# EAGLE schematic Papilio_Benchy (EAGLE 6.5.0)

## Sheet 1 of 5: FPGA
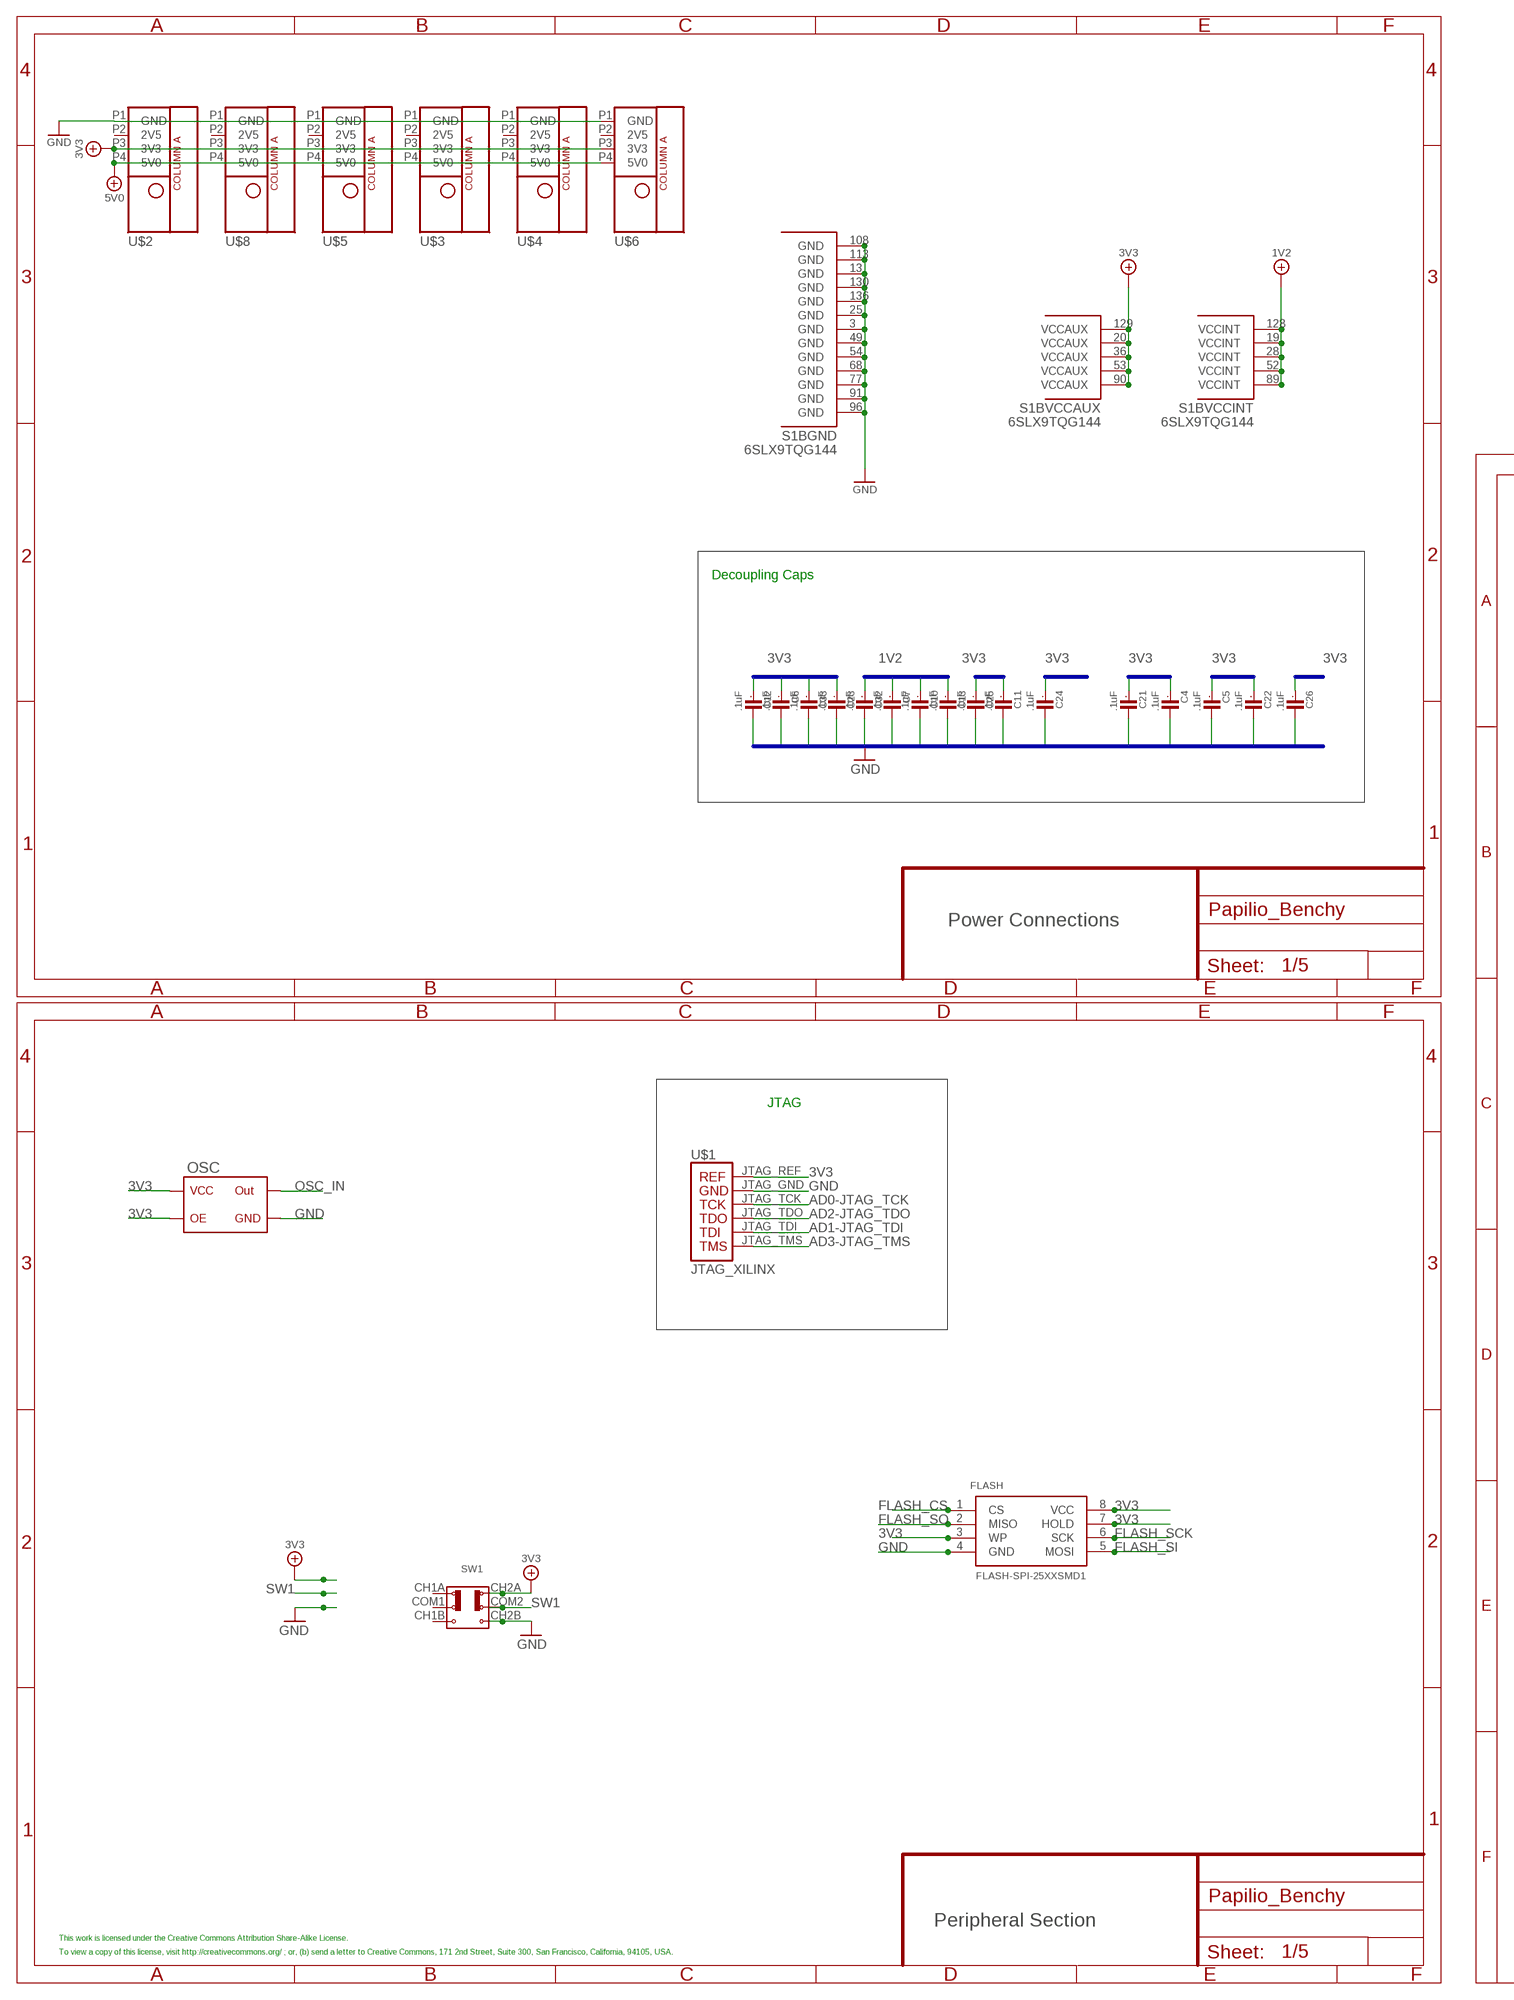
[diagram p0: schematic, sheet 1, part 1 of 2]
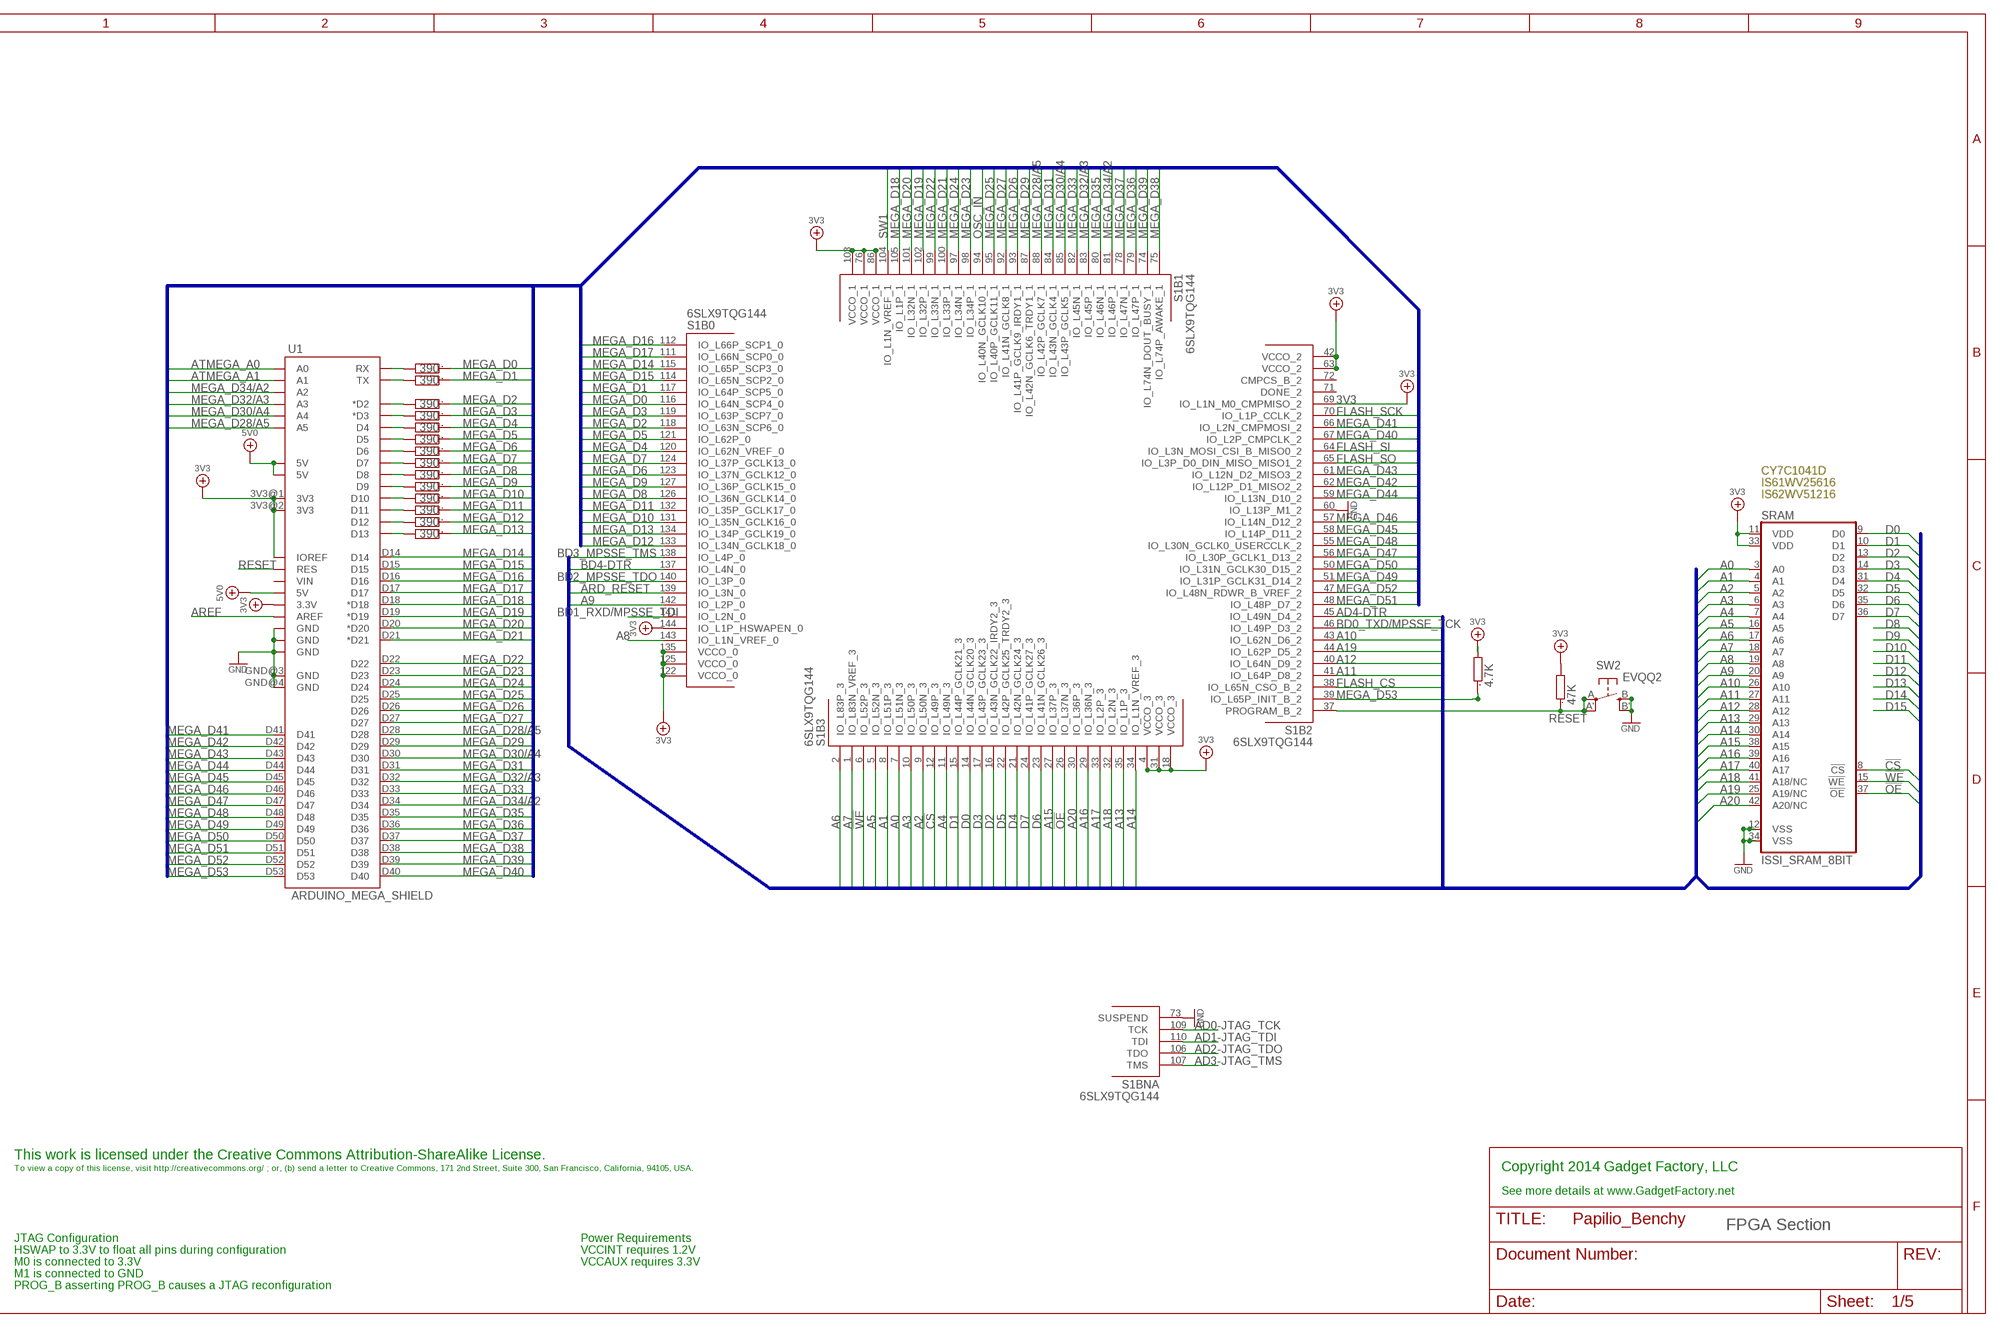
[diagram p1: schematic, sheet 1, part 2 of 2]

### Parts
C4  .1uF  C0603  [0603]
C5  .1uF  C0603  [0603]
C6  .1uF  C0603  [0603]
C7  .1uF  C0603  [0603]
C10  .1uF  C0603  [0603]
C11  .1uF  C0603  [0603]
C12  .1uF  C0603  [0603]
C13  .1uF  C0603  [0603]
C21  .1uF  C0603  [0603]
C22  .1uF  C0603  [0603]
C23  .1uF  C0603  [0603]
C24  .1uF  C0603  [0603]
C25  .1uF  C0603  [0603]
C26  .1uF  C0603  [0603]
C32  .1uF  C0603  [0603]
C33  .1uF  C0603  [0603]
FLASH  FLASH-SPI-25XXSMD1  [SO08-EIAJ]
OSC  OSC1  [OSC1]
R8  390  R0603  [0603]
R9  390  R0603  [0603]
R10  390  R0603  [0603]
R11  390  R0603  [0603]
R12  390  R0603  [0603]
R13  390  R0603  [0603]
R14  390  R0603  [0603]
R15  390  R0603  [0603]
R16  390  R0603  [0603]
R17  390  R0603  [0603]
R18  390  R0603  [0603]
R19  390  R0603  [0603]
R20  390  R0603  [0603]
R21  390  R0603  [0603]
R31  47K  R0805  [0805]
R32  4.7K  R0603  [0603]
S1  6SLX9TQG144  [TQ144]
SRAM  ISSI_SRAM_8BIT  [TSOP44-II]
SW1  SWITCH-2CH-6P-3010010P1  [6P-2CH-2.54-9.1X3.5X3.2+2H]
SW2  EVQQ2  [EVQ-Q2]
U1  ARDUINO_MEGA_SHIELD  [ARDUINO_MEGA_SHIELD]
U$1  JTAG_XILINX  [JTAG]
U$2  POWER_ONLYNOTEXT  [POWER_NO_TEXT]
U$3  POWER_ONLYNOTEXT  [POWER_NO_TEXT]
U$4  POWER_ONLYNOTEXT  [POWER_NO_TEXT]
U$5  POWER_ONLYNOTEXT  [POWER_NO_TEXT]
U$6  POWER_ONLYNOTEXT  [POWER_NO_TEXT]
U$8  POWER_ONLYNOTEXT  [POWER_NO_TEXT]

### Nets
1V2: C7.1 C10.1 C13.1 C32.1 S1.19(BVCCINT:VCCINT) S1.28(BVCCINT:VCCINT) S1.52(BVCCINT:VCCINT) S1.89(BVCCINT:VCCINT) S1.128(BVCCINT:VCCINT) ; also sheet 2
3V3: C4.1 C5.1 C6.1 C11.1 C12.1 C21.1 C22.1 C23.1 C24.1 C25.1 C26.1 C33.1 FLASH.3(WP) FLASH.7(HOLD) FLASH.8(VCC) OSC.1@1(OE) OSC.4@4(VCC) R31.2 R32.2 S1.4(B3:VCCO_3) S1.18(B3:VCCO_3) S1.20(BVCCAUX:VCCAUX) S1.31(B3:VCCO_3) S1.36(BVCCAUX:VCCAUX) S1.42(B2:VCCO_2) S1.53(BVCCAUX:VCCAUX) S1.63(B2:VCCO_2) S1.69(B2:IO_L1N_M0_CMPMISO_2) S1.76(B1:VCCO_1) S1.86(B1:VCCO_1) S1.90(BVCCAUX:VCCAUX) S1.103(B1:VCCO_1) S1.122(B0:VCCO_0) S1.125(B0:VCCO_0) S1.129(BVCCAUX:VCCAUX) S1.135(B0:VCCO_0) S1.144(B0:IO_L1P_HSWAPEN_0) SRAM.11(VDD) SRAM.33(VDD) SW1.CH2A U1.3.3V U1.3V3@1(3V3) U1.3V3@2(3V3) U1.IOREF U$1.JTAG_REF U$2.P3(3V3) U$3.P3(3V3) U$4.P3(3V3) U$5.P3(3V3) U$6.P3(3V3) U$8.P3(3V3) ; also sheet 2,3,4,5
5V0: U1.5V@0(5V) U1.5V@1(5V) U1.5V@2(5V) U$2.P4(5V0) U$3.P4(5V0) U$4.P4(5V0) U$5.P4(5V0) U$6.P4(5V0) U$8.P4(5V0) ; also sheet 2,5
!CS: S1.12(B3:IO_L49P_3) SRAM.8(!CS)
!OE: S1.26(B3:IO_L37N_3) SRAM.37(!OE)
!WE: S1.6(B3:IO_L52P_3) SRAM.15(!WE)
A0: S1.7(B3:IO_L51N_3) SRAM.3(A0)
A1: S1.8(B3:IO_L51P_3) SRAM.4(A1)
A2: S1.9(B3:IO_L50N_3) SRAM.5(A2)
A3: S1.10(B3:IO_L50P_3) SRAM.6(A3)
A4: S1.11(B3:IO_L49N_3) SRAM.7(A4)
A5: S1.5(B3:IO_L52N_3) SRAM.16(A5)
A6: S1.2(B3:IO_L83P_3) SRAM.17(A6)
A7: S1.1(B3:IO_L83N_VREF_3) SRAM.18(A7)
A8: S1.143(B0:IO_L1N_VREF_0) SRAM.19(A8)
A9: S1.142(B0:IO_L2P_0) SRAM.20(A9)
A10: S1.43(B2:IO_L62N_D6_2) SRAM.26(A10)
A11: S1.41(B2:IO_L64P_D8_2) SRAM.27(A11)
A12: S1.40(B2:IO_L64N_D9_2) SRAM.28(A12)
A13: S1.35(B3:IO_L1P_3) SRAM.29(A13)
A14: S1.34(B3:IO_L1N_VREF_3) SRAM.30(A14)
A15: S1.27(B3:IO_L37P_3) SRAM.38(A15)
A16: S1.29(B3:IO_L36N_3) SRAM.39(A16)
A17: S1.33(B3:IO_L2P_3) SRAM.40(A17)
A18: S1.32(B3:IO_L2N_3) SRAM.41(A18/NC)
A19: S1.44(B2:IO_L62P_D5_2) SRAM.25(A19/NC)
A20: S1.30(B3:IO_L36P_3) SRAM.42(A20/NC)
AD0-JTAG_TCK: S1.109(BNA:TCK) U$1.JTAG_TCK ; also sheet 3
AD1-JTAG_TDI: S1.110(BNA:TDI) U$1.JTAG_TDI ; also sheet 3
AD2-JTAG_TDO: S1.106(BNA:TDO) U$1.JTAG_TDO ; also sheet 3
AD3-JTAG_TMS: S1.107(BNA:TMS) U$1.JTAG_TMS ; also sheet 3
AD4-DTR: S1.45(B2:IO_L49N_D4_2) ; also sheet 3
ARD_RESET: S1.139(B0:IO_L3N_0) ; also sheet 4
AREF [aref]: U1.AREF ; also sheet 4
ATMEGA_A0: U1.A0 ; also sheet 4
ATMEGA_A1: U1.A1 ; also sheet 4
ATMEGA_D0/RX: R21.2 U1.RX ; also sheet 4
ATMEGA_D1/TX: R20.2 U1.TX ; also sheet 4
ATMEGA_D2: R19.2 U1.D2(*D2) ; also sheet 4
ATMEGA_D3: R18.2 U1.D3(*D3) ; also sheet 4
ATMEGA_D4: R17.2 U1.D4 ; also sheet 4
ATMEGA_D5*: R16.2 U1.D5 ; also sheet 4
ATMEGA_D6*: R15.2 U1.D6 ; also sheet 4
ATMEGA_D7: R14.2 U1.D7 ; also sheet 4
ATMEGA_IO8: R13.2 U1.D8 ; also sheet 4
ATMEGA_IO9*: R12.2 U1.D9 ; also sheet 4
ATMEGA_IO10*: R11.2 U1.D10 ; also sheet 4
ATMEGA_IO11*: R10.2 U1.D11 ; also sheet 4
ATMEGA_IO12: R9.2 U1.D12 ; also sheet 4
ATMEGA_IO13*: R8.2 U1.D13 ; also sheet 4
BD0_TXD/MPSSE_TCK: S1.46(B2:IO_L49P_D3_2) ; also sheet 3
BD1_RXD/MPSSE_TDI: S1.141(B0:IO_L2N_0) ; also sheet 3
BD2_MPSSE_TDO: S1.140(B0:IO_L3P_0) ; also sheet 3
BD3_MPSSE_TMS: S1.138(B0:IO_L4P_0) ; also sheet 3
BD4-DTR: S1.137(B0:IO_L4N_0) ; also sheet 3
D0: S1.14(B3:IO_L44N_GCLK20_3) SRAM.9(D0)
D1: S1.15(B3:IO_L44P_GCLK21_3) SRAM.10(D1)
D2: S1.16(B3:IO_L43N_GCLK22_IRDY2_3) SRAM.13(D2)
D3: S1.17(B3:IO_L43P_GCLK23_3) SRAM.14(D3)
D4: S1.21(B3:IO_L42N_GCLK24_3) SRAM.31(D4)
D5: S1.22(B3:IO_L42P_GCLK25_TRDY2_3) SRAM.32(D5)
D6: S1.23(B3:IO_L41N_GCLK26_3) SRAM.35(D6)
D7: S1.24(B3:IO_L41P_GCLK27_3) SRAM.36(D7)
FLASH_CS: FLASH.1(CS) S1.38(B2:IO_L65N_CSO_B_2)
FLASH_SCK: FLASH.6(SCK) S1.70(B2:IO_L1P_CCLK_2)
FLASH_SI: FLASH.5(MOSI) S1.64(B2:IO_L3N_MOSI_CSI_B_MISO0_2)
FLASH_SO: FLASH.2(MISO) S1.65(B2:IO_L3P_D0_DIN_MISO_MISO1_2)
GND: C4.2 C5.2 C6.2 C7.2 C10.2 C11.2 C12.2 C13.2 C21.2 C22.2 C23.2 C24.2 C25.2 C26.2 C32.2 C33.2 FLASH.4(GND) OSC.2@2(GND) S1.3(BGND:GND) S1.13(BGND:GND) S1.25(BGND:GND) S1.49(BGND:GND) S1.54(BGND:GND) S1.60(B2:IO_L13P_M1_2) S1.68(BGND:GND) S1.73(BNA:SUSPEND) S1.77(BGND:GND) S1.91(BGND:GND) S1.96(BGND:GND) S1.108(BGND:GND) S1.113(BGND:GND) S1.130(BGND:GND) S1.136(BGND:GND) SRAM.12(VSS) SRAM.34(VSS) SW1.CH2B SW2.B'(S1) SW2.B(S) U1.GND@0(GND) U1.GND@1(GND) U1.GND@2(GND) U1.GND@3(GND) U1.GND@4(GND) U$1.JTAG_GND U$2.P1(GND) U$3.P1(GND) U$4.P1(GND) U$5.P1(GND) U$6.P1(GND) U$8.P1(GND) ; also sheet 2,3,4,5
MEGA_D0: R21.1 S1.116(B0:IO_L64N_SCP4_0)
MEGA_D1: R20.1 S1.117(B0:IO_L64P_SCP5_0)
MEGA_D2: R19.1 S1.118(B0:IO_L63N_SCP6_0)
MEGA_D3: R18.1 S1.119(B0:IO_L63P_SCP7_0)
MEGA_D4: R17.1 S1.120(B0:IO_L62N_VREF_0)
MEGA_D5: R16.1 S1.121(B0:IO_L62P_0)
MEGA_D6: R15.1 S1.123(B0:IO_L37N_GCLK12_0)
MEGA_D7: R14.1 S1.124(B0:IO_L37P_GCLK13_0)
MEGA_D8: R13.1 S1.126(B0:IO_L36N_GCLK14_0)
MEGA_D9: R12.1 S1.127(B0:IO_L36P_GCLK15_0)
MEGA_D10: R11.1 S1.131(B0:IO_L35N_GCLK16_0)
MEGA_D11: R10.1 S1.132(B0:IO_L35P_GCLK17_0)
MEGA_D12: R9.1 S1.133(B0:IO_L34N_GCLK18_0)
MEGA_D13: R8.1 S1.134(B0:IO_L34P_GCLK19_0)
MEGA_D14: S1.115(B0:IO_L65P_SCP3_0) U1.D14 ; also sheet 4
MEGA_D15: S1.114(B0:IO_L65N_SCP2_0) U1.D15 ; also sheet 4
MEGA_D16: S1.112(B0:IO_L66P_SCP1_0) U1.D16 ; also sheet 4
MEGA_D17: S1.111(B0:IO_L66N_SCP0_0) U1.D17
MEGA_D18: S1.105(B1:IO_L1P_1) U1.D18(*D18)
MEGA_D19: S1.102(B1:IO_L32P_1) U1.D19(*D19)
MEGA_D20: S1.101(B1:IO_L32N_1) U1.D20(*D20)
MEGA_D21: S1.100(B1:IO_L33P_1) U1.D21(*D21)
MEGA_D22: S1.99(B1:IO_L33N_1) U1.D22
MEGA_D23: S1.98(B1:IO_L34P_1) U1.D23
MEGA_D24: S1.97(B1:IO_L34N_1) U1.D24
MEGA_D25: S1.95(B1:IO_L40P_GCLK11_1) U1.D25
MEGA_D26: S1.93(B1:IO_L41P_GCLK9_IRDY1_1) U1.D26
MEGA_D27: S1.92(B1:IO_L41N_GCLK8_1) U1.D27
MEGA_D28/A5: S1.88(B1:IO_L42P_GCLK7_1) U1.A5 U1.D28 ; also sheet 4
MEGA_D29: S1.87(B1:IO_L42N_GCLK6_TRDY1_1) U1.D29
MEGA_D30/A4: S1.85(B1:IO_L43P_GCLK5_1) U1.A4 U1.D30 ; also sheet 4
MEGA_D31: S1.84(B1:IO_L43N_GCLK4_1) U1.D31
MEGA_D32/A3: S1.83(B1:IO_L45P_1) U1.A3 U1.D32 ; also sheet 4
MEGA_D33: S1.82(B1:IO_L45N_1) U1.D33
MEGA_D34/A2: S1.81(B1:IO_L46P_1) U1.A2 U1.D34 ; also sheet 4
MEGA_D35: S1.80(B1:IO_L46N_1) U1.D35
MEGA_D36: S1.79(B1:IO_L47P_1) U1.D36
MEGA_D37: S1.78(B1:IO_L47N_1) U1.D37
MEGA_D38: S1.75(B1:IO_L74P_AWAKE_1) U1.D38
MEGA_D39: S1.74(B1:IO_L74N_DOUT_BUSY_1) U1.D39
MEGA_D40: S1.67(B2:IO_L2P_CMPCLK_2) U1.D40
MEGA_D41: S1.66(B2:IO_L2N_CMPMOSI_2) U1.D41
MEGA_D42: S1.62(B2:IO_L12P_D1_MISO2_2) U1.D42
MEGA_D43: S1.61(B2:IO_L12N_D2_MISO3_2) U1.D43 ; also sheet 5
MEGA_D44: S1.59(B2:IO_L13N_D10_2) U1.D44 ; also sheet 5
MEGA_D45: S1.58(B2:IO_L14P_D11_2) U1.D45 ; also sheet 5
MEGA_D46: S1.57(B2:IO_L14N_D12_2) U1.D46 ; also sheet 5
MEGA_D47: S1.56(B2:IO_L30P_GCLK1_D13_2) U1.D47 ; also sheet 5
MEGA_D48: S1.55(B2:IO_L30N_GCLK0_USERCCLK_2) U1.D48 ; also sheet 5
MEGA_D49: S1.51(B2:IO_L31P_GCLK31_D14_2) U1.D49 ; also sheet 5
MEGA_D50: S1.50(B2:IO_L31N_GCLK30_D15_2) U1.D50 ; also sheet 5
MEGA_D51: S1.48(B2:IO_L48P_D7_2) U1.D51 ; also sheet 5
MEGA_D52: S1.47(B2:IO_L48N_RDWR_B_VREF_2) U1.D52 ; also sheet 5
MEGA_D53: R32.1 S1.39(B2:IO_L65P_INIT_B_2) U1.D53 ; also sheet 5
OSC_IN: OSC.3@3(OUT) S1.94(B1:IO_L40N_GCLK10_1)
RESET: R31.1 S1.37(B2:PROGRAM_B_2) SW2.A'(P1) SW2.A(P) U1.RES
SW1: S1.104(B1:IO_L1N_VREF_1) SW1.COM2
Unconnected: S1.71(B2:DONE_2) S1.72(B2:CMPCS_B_2) SW1.CH1A SW1.CH1B SW1.COM1 U1.VIN U$2.P2(2V5) U$3.P2(2V5) U$4.P2(2V5) U$5.P2(2V5) U$6.P2(2V5) U$8.P2(2V5)

### Buses
GND
1V2
MEGA_A[0..15],MEGA_D[0..53],W1_B[1..16],OSC_IN,FLASH_SCK,FLASH_SI,FLASH_SO,FLASH_CS,USB_TXD,USB_RXD,LED1,LED2,LED3,LED4
3V3
A[0..20],D[0..15],CS,WE,OE,BE,LED4

### Notes on the sheet
- Decoupling Caps
- Power Connections
- CY7C1041D
- IS61WV25616
- IS62WV51216
- JTAG
- RESET
- This work is licensed under the Creative Commons Attribution-ShareAlike License.
- To view a copy of this license, visit http://creativecommons.org/ ; or, (b) send a letter to Creative Commons, 171 2nd Street, Suite 300, San Francisco, California, 94105, USA. | Copyright 2014 Gadget Factory, LLC
- See more details at www.GadgetFactory.net
- FPGA Section
- JTAG Configuration | Power Requirements
- HSWAP to 3.3V to float all pins during configuration | VCCINT requires 1.2V
- Peripheral Section | M0 is connected to 3.3V | VCCAUX requires 3.3V
- This work is licensed under the Creative Commons Attribution Share-Alike License. | M1 is connected to GND
- To view a copy of this license, visit http://creativecommons.org/ ; or, (b) send a letter to Creative Commons, 171 2nd Street, Suite 300, San Francisco, California, 94105, USA. | PROG_B asserting PROG_B causes a JTAG reconfiguration

## Sheet 2 of 5: Power
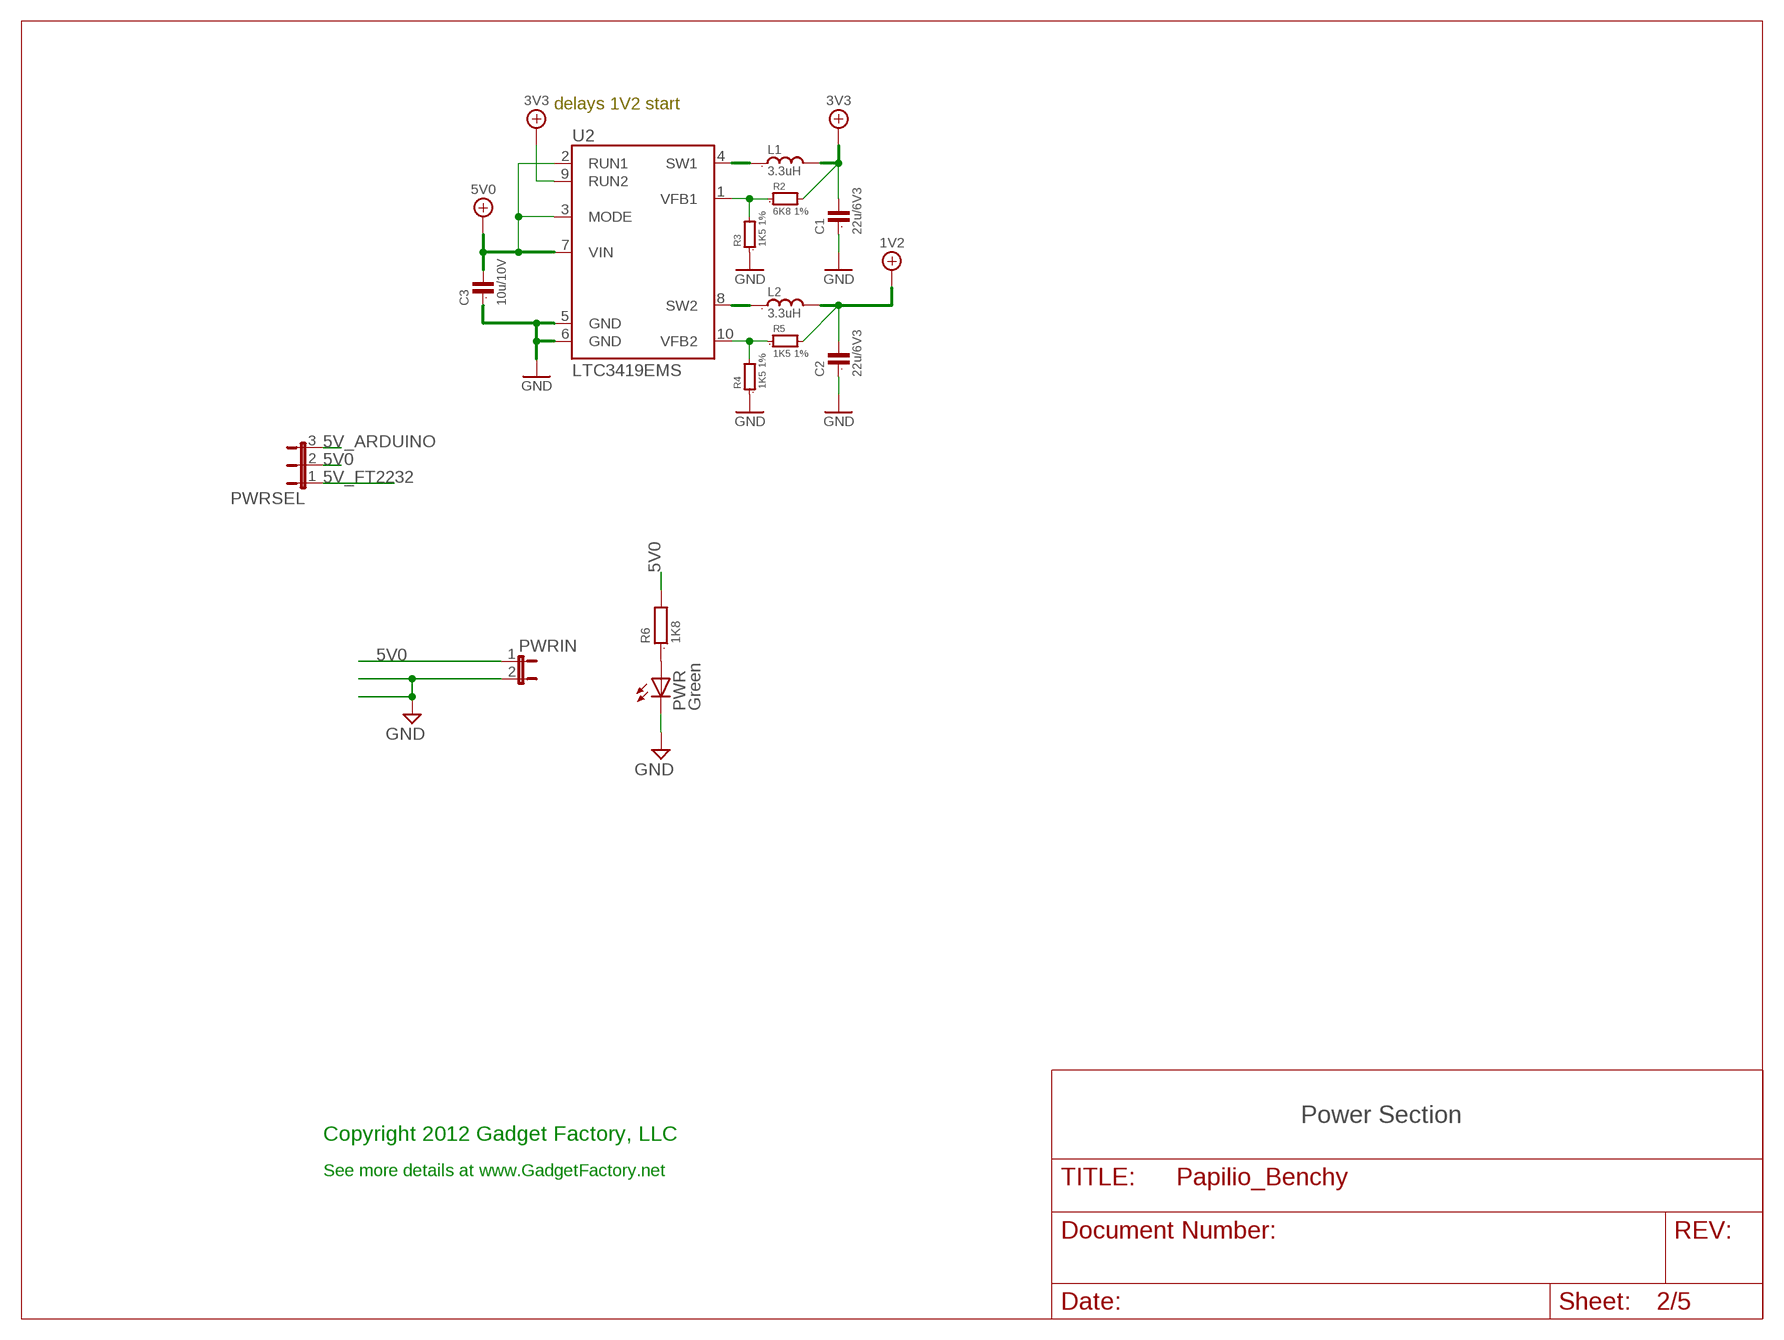
[diagram p2: schematic, sheet 2]

### Parts
C1  22u/6V3  C0805  [0805]
C2  22u/6V3  C0805  [0805]
C3  10u/10V  C0805  [0805]
L1  3.3uH  L_VLS3015  [VLS3015]
L2  3.3uH  L_VLS3015  [VLS3015]
PWR  Green  LEDCHIP-LED0805  [CHIP-LED0805]
PWRIN  JP1E  [JP1]
PWRSEL  JP2E  [JP2]
R2  6K8 1%  R-SMALL0603  [0603]
R3  1K5 1%  R-SMALL0603  [0603]
R4  1K5 1%  R-SMALL0603  [0603]
R5  1K5 1%  R-SMALL0603  [0603]
R6  1K8  R0603  [0603]
U2  LTC3419EMS  [MSOP10]

### Nets
1V2: C2.2 L2.2 R5.2 ; also sheet 1
3V3: C1.2 L1.2 R2.2 U2.9(RUN2) ; also sheet 1,3,4,5
5V0: C3.2 PWRIN.1 PWRSEL.2 R6.2 U2.2(RUN1) U2.3(MODE) U2.7(VIN) ; also sheet 1,5
5V_ARDUINO [usbvcc]: PWRSEL.3 ; also sheet 4
5V_FT2232: PWRSEL.1 ; also sheet 3
FB_1V2: R4.2 R5.1 U2.10(VFB2)
FB_3V3: R2.1 R3.2 U2.1(VFB1)
GND: C1.1 C2.1 C3.1 PWR.C PWRIN.2 R3.1 R4.1 U2.5(GND) U2.6(GND) ; also sheet 1,3,4,5
N$8: PWR.A R6.1
SW_1V2: L2.1 U2.8(SW2)
SW_3V3: L1.1 U2.4(SW1)

### Notes on the sheet
- delays 1V2 start
- Power Section
- Copyright 2012 Gadget Factory, LLC
- See more details at www.GadgetFactory.net

## Sheet 3 of 5: FT2232H
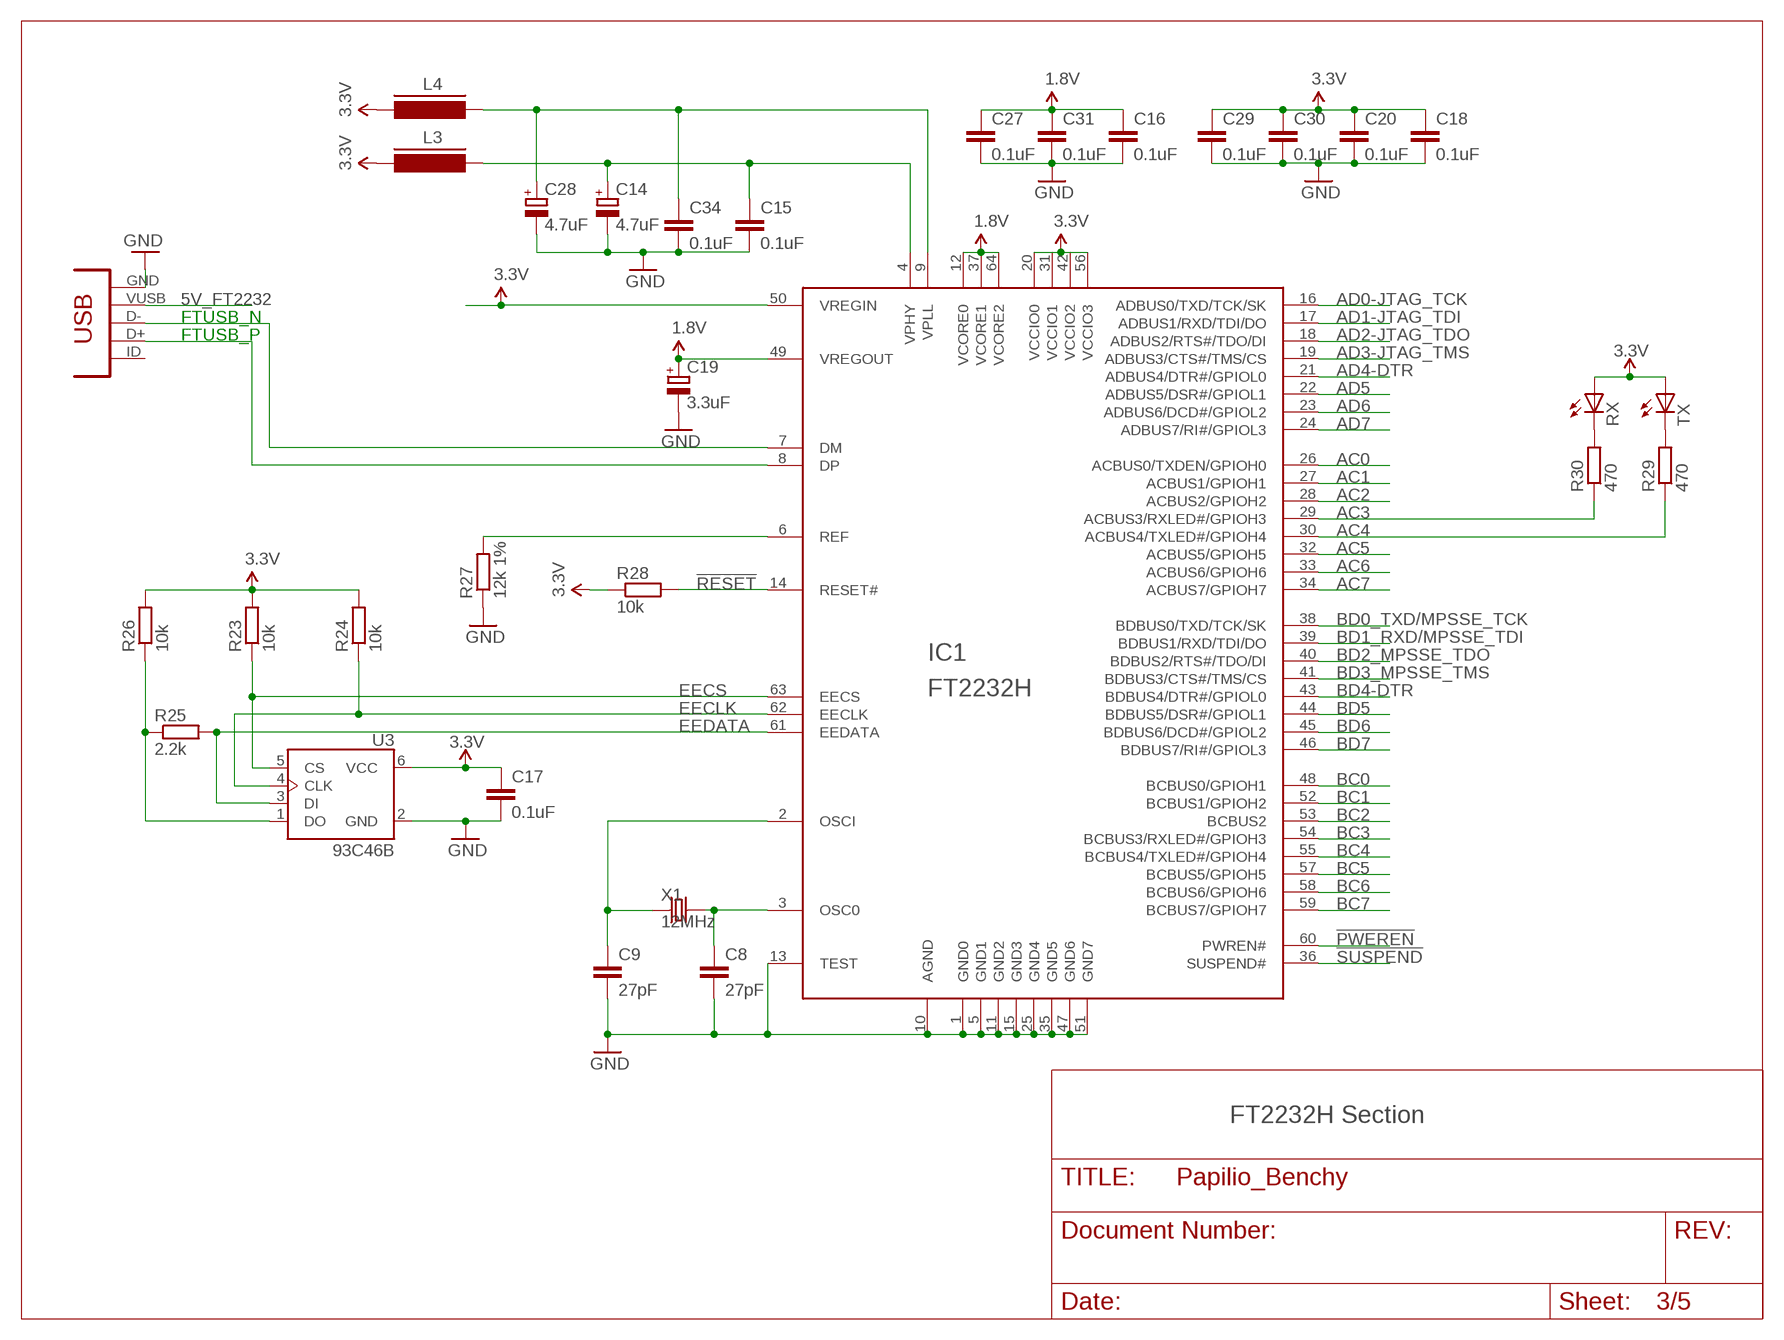
[diagram p3: schematic, sheet 3]

### Parts
C8  27pF  CAPC603  [C603]
C9  27pF  CAPC603  [C603]
C14  4.7uF  CAP_POLSMC_A  [SMC_A]
C15  0.1uF  CAPC603  [C603]
C16  0.1uF  CAPC603  [C603]
C17  0.1uF  CAPC603  [C603]
C18  0.1uF  CAPC603  [C603]
C19  3.3uF  CAP_POLSMC_A  [SMC_A]
C20  0.1uF  CAPC603  [C603]
C27  0.1uF  CAPC603  [C603]
C28  4.7uF  CAP_POLSMC_A  [SMC_A]
C29  0.1uF  CAPC603  [C603]
C30  0.1uF  CAPC603  [C603]
C31  0.1uF  CAPC603  [C603]
C34  0.1uF  CAPC603  [C603]
FPGAUSB  CONN_USB  [CONN_USB_MINI-B]
IC1  FT2232H  [LQFP64]
L3  FERRITE_BEAD603  [FB603]
L4  FERRITE_BEAD603  [FB603]
R23  10k  RESISTORR603  [R603]
R24  10k  RESISTORR603  [R603]
R25  2.2k  RESISTORR603  [R603]
R26  10k  RESISTORR603  [R603]
R27  12k 1%  RESISTORR603  [R603]
R28  10k  RESISTORR603  [R603]
R29  470  RESISTORR603  [R603]
R30  470  RESISTORR603  [R603]
RX  LED805  [LED-805]
TX  LED805  [LED-805]
U3  93C46B  DIGITAL-EEPROM-MICROWIRE-6P_SOT23  [SOT23-6]
X1  12MHz  CRYSTAL_212M_  [4X6]

### Nets
1.8V: C16.1 C19.+ C27.1 C31.1 IC1.12(VCORE0) IC1.37(VCORE1) IC1.49(VREGOUT) IC1.64(VCORE2)
3V3: C17.1 C18.1 C20.1 C29.1 C30.1 IC1.20(VCCIO0) IC1.31(VCCIO1) IC1.42(VCCIO2) IC1.50(VREGIN) IC1.56(VCCIO3) L3.2 L4.2 R23.2 R24.2 R26.2 R28.1 RX.A TX.A U3.6(VCC) ; supply symbol labelled 3.3V ; also sheet 1,2,4,5
5V_FT2232: FPGAUSB.VUSB ; also sheet 2
!PWEREN: IC1.60(PWREN#)
!RESET: IC1.14(RESET#) R28.2
!SUSPEND: IC1.36(SUSPEND#)
AC0: IC1.26(ACBUS0/TXDEN/GPIOH0)
AC1: IC1.27(ACBUS1/GPIOH1)
AC2: IC1.28(ACBUS2/GPIOH2)
AC3: IC1.29(ACBUS3/RXLED#/GPIOH3) R30.1
AC4: IC1.30(ACBUS4/TXLED#/GPIOH4) R29.1
AC5: IC1.32(ACBUS5/GPIOH5)
AC6: IC1.33(ACBUS6/GPIOH6)
AC7: IC1.34(ACBUS7/GPIOH7)
AD0-JTAG_TCK: IC1.16(ADBUS0/TXD/TCK/SK) ; also sheet 1
AD1-JTAG_TDI: IC1.17(ADBUS1/RXD/TDI/DO) ; also sheet 1
AD2-JTAG_TDO: IC1.18(ADBUS2/RTS#/TDO/DI) ; also sheet 1
AD3-JTAG_TMS: IC1.19(ADBUS3/CTS#/TMS/CS) ; also sheet 1
AD4-DTR: IC1.21(ADBUS4/DTR#/GPIOL0) ; also sheet 1
AD5: IC1.22(ADBUS5/DSR#/GPIOL1)
AD6: IC1.23(ADBUS6/DCD#/GPIOL2)
AD7: IC1.24(ADBUS7/RI#/GPIOL3)
BC0: IC1.48(BCBUS0/GPIOH1)
BC1: IC1.52(BCBUS1/GPIOH2)
BC2: IC1.53(BCBUS2)
BC3: IC1.54(BCBUS3/RXLED#/GPIOH3)
BC4: IC1.55(BCBUS4/TXLED#/GPIOH4)
BC5: IC1.57(BCBUS5/GPIOH5)
BC6: IC1.58(BCBUS6/GPIOH6)
BC7: IC1.59(BCBUS7/GPIOH7)
BD0_TXD/MPSSE_TCK: IC1.38(BDBUS0/TXD/TCK/SK) ; also sheet 1
BD1_RXD/MPSSE_TDI: IC1.39(BDBUS1/RXD/TDI/DO) ; also sheet 1
BD2_MPSSE_TDO: IC1.40(BDBUS2/RTS#/TDO/DI) ; also sheet 1
BD3_MPSSE_TMS: IC1.41(BDBUS3/CTS#/TMS/CS) ; also sheet 1
BD4-DTR: IC1.43(BDBUS4/DTR#/GPIOL0) ; also sheet 1
BD5: IC1.44(BDBUS5/DSR#/GPIOL1)
BD6: IC1.45(BDBUS6/DCD#/GPIOL2)
BD7: IC1.46(BDBUS7/RI#/GPIOL3)
EECLK: IC1.62(EECLK) R24.1 U3.4(CLK)
EECS: IC1.63(EECS) R23.1 U3.5(CS)
EEDATA: IC1.61(EEDATA) R25.2 U3.3(DI)
FTUSB_N: FPGAUSB.D- IC1.7(DM)
FTUSB_P: FPGAUSB.D+ IC1.8(DP)
GND: C8.2 C9.2 C14.- C15.2 C16.2 C17.2 C18.2 C19.- C20.2 C27.2 C28.- C29.2 C30.2 C31.2 C34.2 FPGAUSB.GND IC1.1(GND0) IC1.5(GND1) IC1.10(AGND) IC1.11(GND2) IC1.13(TEST) IC1.15(GND3) IC1.25(GND4) IC1.35(GND5) IC1.47(GND6) IC1.51(GND7) R27.1 U3.2(GND) ; also sheet 1,2,4,5
N$9: IC1.6(REF) R27.2
N$22: C9.1 IC1.2(OSCI) X1.1(X1)
N$23: C8.1 IC1.3(OSC0) X1.2(X2)
N$24: R30.2 RX.C
N$25: R29.2 TX.C
N$45: R25.1 R26.1 U3.1(DO)
N$48: C14.+ C15.1 IC1.4(VPHY) L3.1
N$49: C28.+ C34.1 IC1.9(VPLL) L4.1
Unconnected: FPGAUSB.BODY@1(BODY) FPGAUSB.BODY@2(BODY) FPGAUSB.BODY@3(BODY) FPGAUSB.BODY@4(BODY) FPGAUSB.ID(USBID)

### Notes on the sheet
- FT2232H Section

## Sheet 4 of 5: Arduino
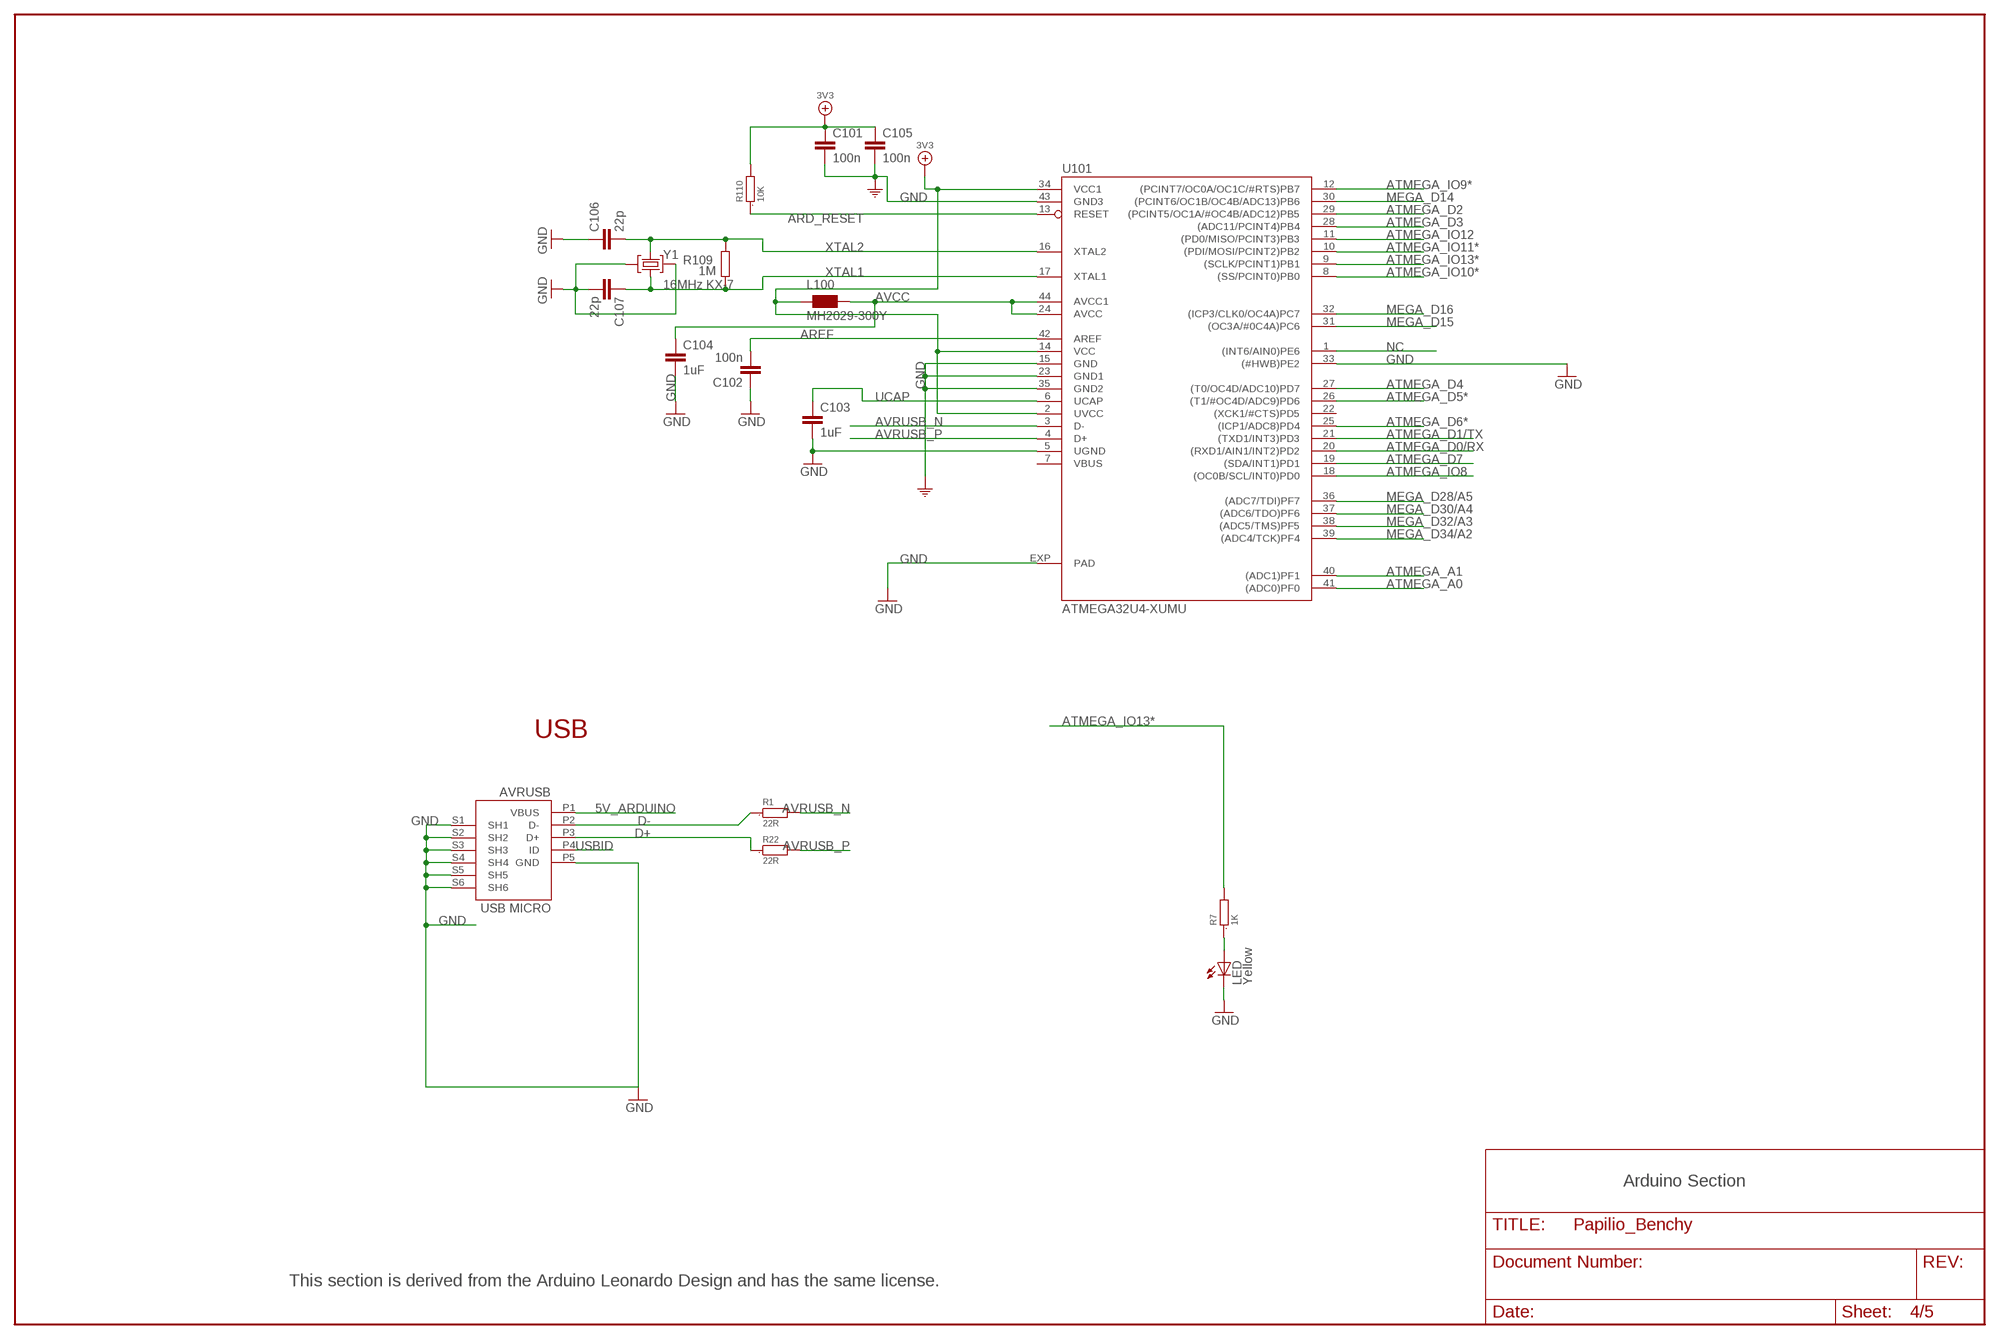
[diagram p4: schematic, sheet 4]

### Parts
AVRUSB  USB MICRO  MYCON2_USB-MINI-B  [CON2_USB_MICRO_B_AT]
C101  100n  C-EUC0603K  [C0603K]
C102  100n  C-EUC0603K  [C0603K]
C103  1uF  C-EUC0603K  [C0603K]
C104  1uF  C-EUC0603K  [C0603K]
C105  100n  C-EUC0603K  [C0603K]
C106  22p  C-EUC0603K  [C0603K]
C107  22p  C-EUC0603K  [C0603K]
L100  MH2029-300Y  WE-CBF_0805  [0805]
LED  Yellow  LEDCHIPLED_0805  [CHIPLED_0805]
R1  22R  R0805  [0805]
R7  1K  R0603  [0603]
R22  22R  R0805  [0805]
R109  1M  R-EU_R0603  [R0603-ROUND]
R110  10K  R0603  [0603]
U101  ATMEGA32U4-XUMU  [QFN44ML7X7]
Y1  16MHz KX-7  CRYSTAL-3.2-2.5  [CRYSTAL-3.2-2.5]

### Nets
3V3: C101.1 C105.1 L100.1 R110.2 U101.2(UVCC) U101.14(VCC) U101.34(VCC1) ; also sheet 1,2,3,5
5V_ARDUINO [usbvcc]: AVRUSB.P1(VBUS) ; also sheet 2
ARD_RESET: R110.1 U101.13(RESET) ; also sheet 1
AREF [aref]: C102.2 U101.42(AREF) ; also sheet 1
ATMEGA_A0: U101.41((ADC0)PF0) ; also sheet 1
ATMEGA_A1: U101.40((ADC1)PF1) ; also sheet 1
ATMEGA_D0/RX: U101.20((RXD1/AIN1/INT2)PD2) ; also sheet 1
ATMEGA_D1/TX: U101.21((TXD1/INT3)PD3) ; also sheet 1
ATMEGA_D2: U101.29((PCINT5/OC1A/#OC4B/ADC12)PB5) ; also sheet 1
ATMEGA_D3: U101.28((ADC11/PCINT4)PB4) ; also sheet 1
ATMEGA_D4: U101.27((T0/OC4D/ADC10)PD7) ; also sheet 1
ATMEGA_D5*: U101.26((T1/#OC4D/ADC9)PD6) ; also sheet 1
ATMEGA_D6*: U101.25((ICP1/ADC8)PD4) ; also sheet 1
ATMEGA_D7: U101.19((SDA/INT1)PD1) ; also sheet 1
ATMEGA_IO8: U101.18((OC0B/SCL/INT0)PD0) ; also sheet 1
ATMEGA_IO9*: U101.12((PCINT7/OC0A/OC1C/#RTS)PB7) ; also sheet 1
ATMEGA_IO10*: U101.8((SS/PCINT0)PB0) ; also sheet 1
ATMEGA_IO11*: U101.10((PDI/MOSI/PCINT2)PB2) ; also sheet 1
ATMEGA_IO12: U101.11((PD0/MISO/PCINT3)PB3) ; also sheet 1
ATMEGA_IO13*: R7.2 U101.9((SCLK/PCINT1)PB1) ; also sheet 1
AVCC: C104.1 L100.2 U101.24(AVCC) U101.44(AVCC1)
AVRUSB_N: R1.2 U101.3(D-)
AVRUSB_P: R22.2 U101.4(D+)
D+: AVRUSB.P3(D+) R22.1
D-: AVRUSB.P2(D-) R1.1
GND: AVRUSB.P5(GND) AVRUSB.S1(SH1) AVRUSB.S2(SH2) AVRUSB.S3(SH3) AVRUSB.S4(SH4) AVRUSB.S5(SH5) AVRUSB.S6(SH6) C101.2 C102.1 C103.2 C104.2 C105.2 C106.1 C107.2 LED.C U101.5(UGND) U101.15(GND) U101.23(GND1) U101.33((#HWB)PE2) U101.35(GND2) U101.43(GND3) U101.EXP(PAD) Y1.2(GND) Y1.4(GND) ; supply symbol labelled COM ; also sheet 1,2,3,5
MEGA_D14: U101.30((PCINT6/OC1B/OC4B/ADC13)PB6) ; also sheet 1
MEGA_D15: U101.31((OC3A/#0C4A)PC6) ; also sheet 1
MEGA_D16: U101.32((ICP3/CLK0/OC4A)PC7) ; also sheet 1
MEGA_D28/A5: U101.36((ADC7/TDI)PF7) ; also sheet 1
MEGA_D30/A4: U101.37((ADC6/TDO)PF6) ; also sheet 1
MEGA_D32/A3: U101.38((ADC5/TMS)PF5) ; also sheet 1
MEGA_D34/A2: U101.39((ADC4/TCK)PF4) ; also sheet 1
N$2: LED.A R7.1
NC: U101.1((INT6/AIN0)PE6)
UCAP: C103.1 U101.6(UCAP)
USBID: AVRUSB.P4(ID)
XTAL1: C107.1 R109.1 U101.17(XTAL1) Y1.1(C1)
XTAL2: C106.2 R109.2 U101.16(XTAL2) Y1.3(C2)
Unconnected: U101.7(VBUS) U101.22((XCK1/#CTS)PD5)

### Notes on the sheet
- USB
- Arduino Section
- This section is derived from the Arduino Leonardo Design and has the same license.

## Sheet 5 of 5: HDMI
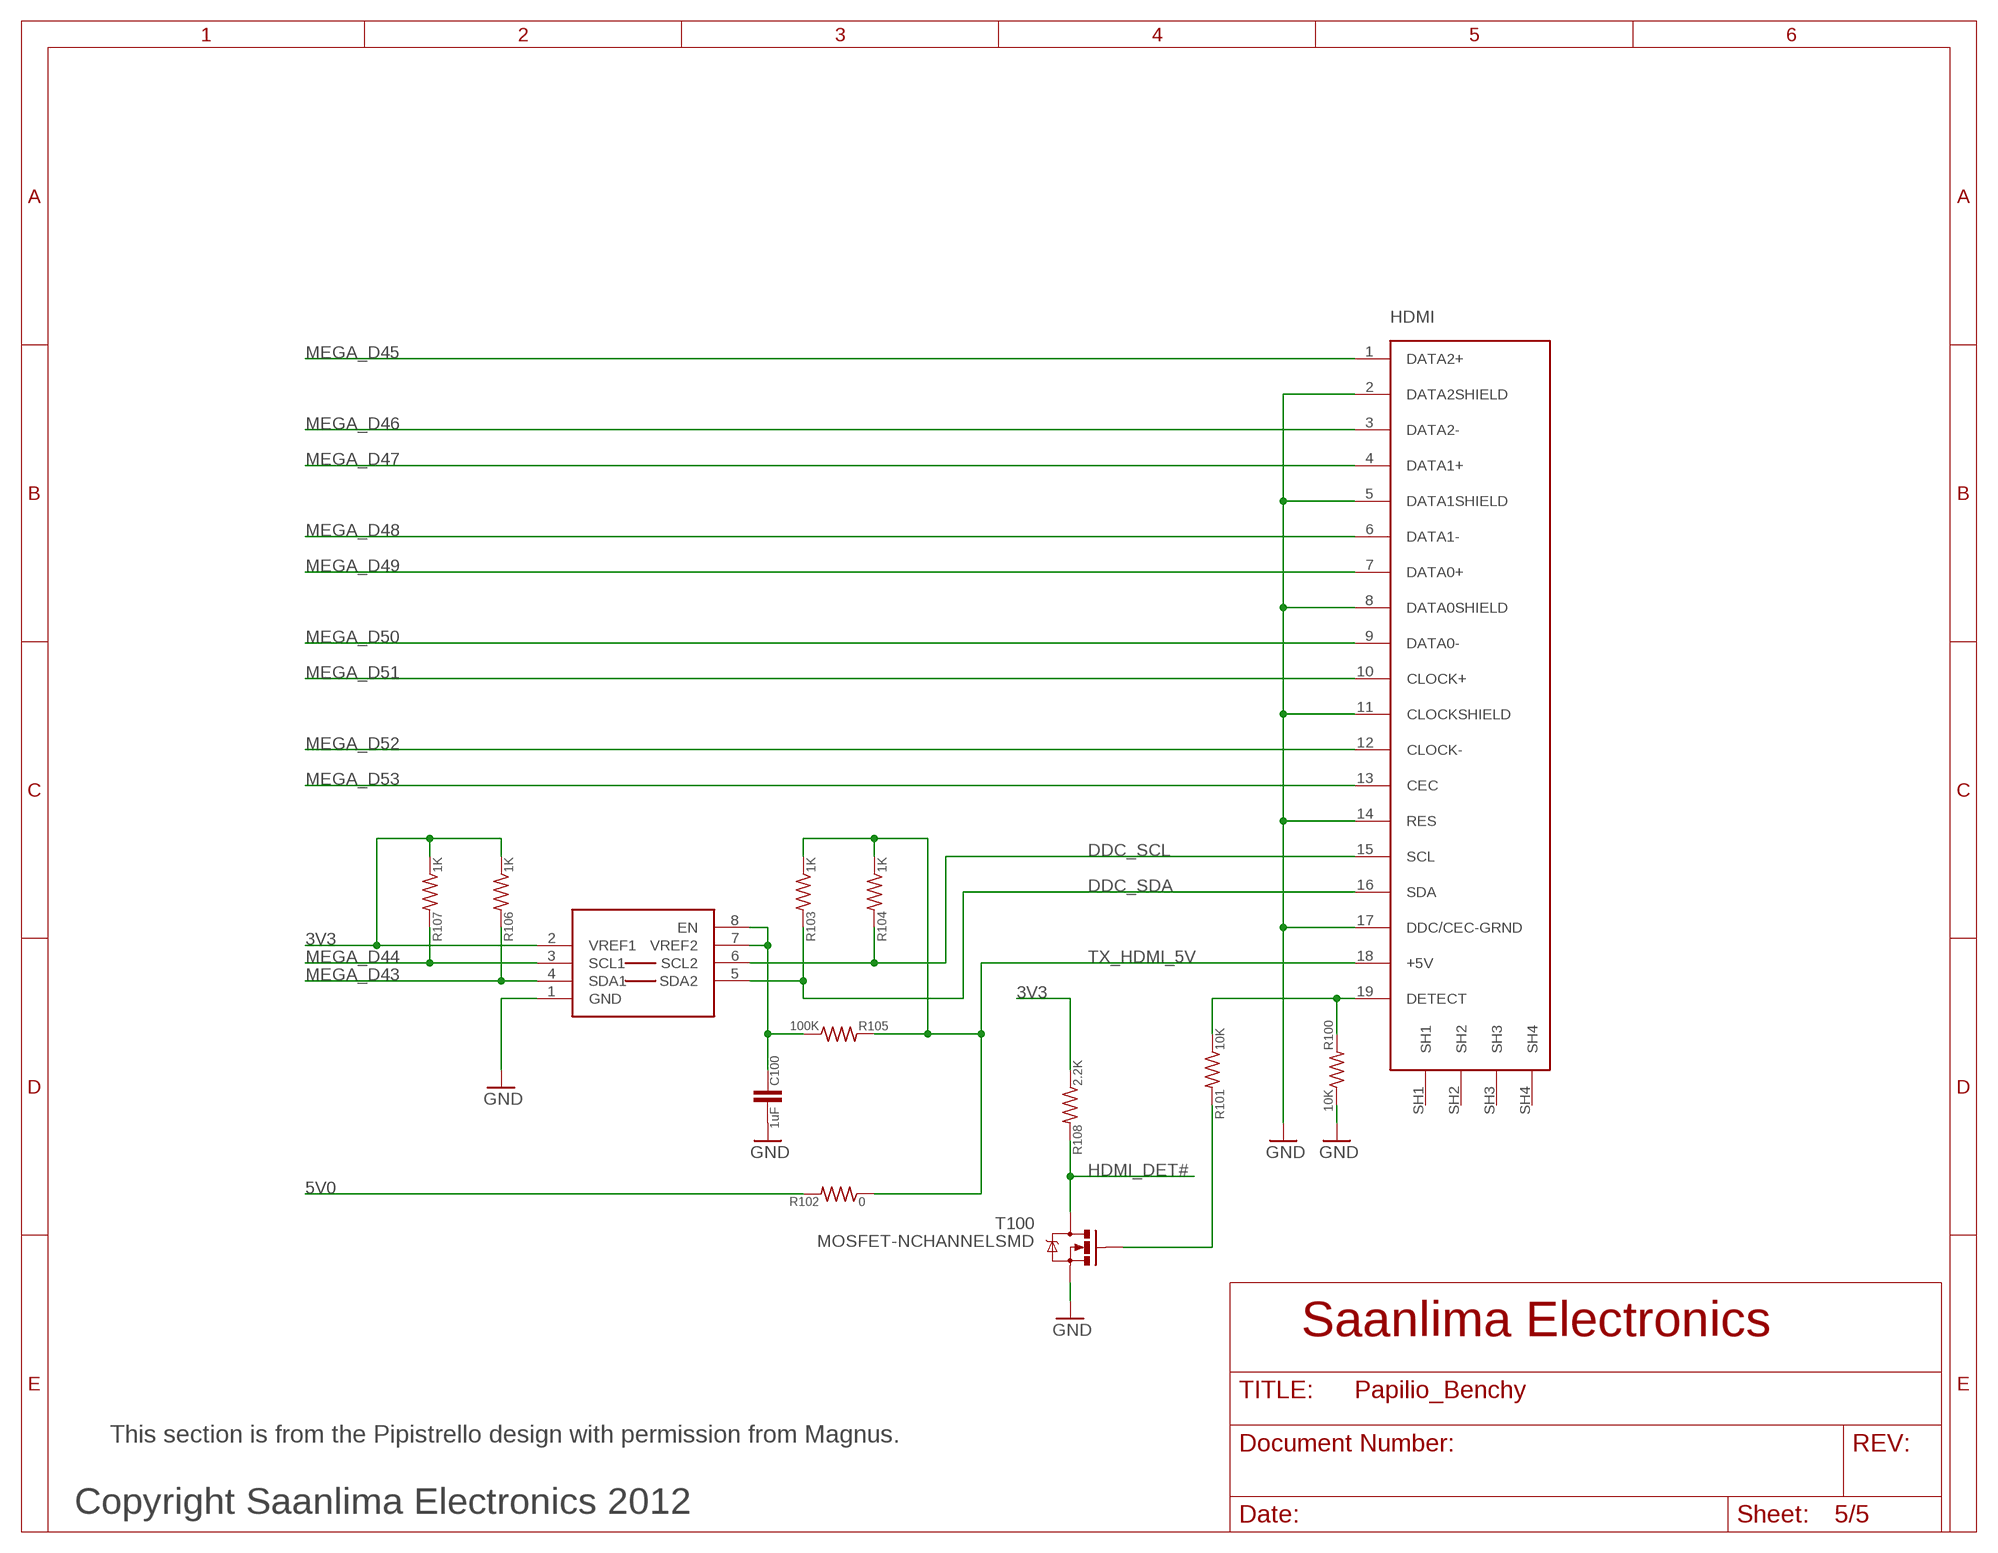
[diagram p5: schematic, sheet 5]

### Parts
C100  1uF  C0402  [0402]
HDMI  HDMI-TYPE-A-RECEPTICALFCI10029449  [FCI-HDMI-TYPE-A-RECEPT]
R100  10K  R0402  [0402]
R101  10K  R0402  [0402]
R102  0  R0402  [0402]
R103  1K  R0402  [0402]
R104  1K  R0402  [0402]
R105  100K  R0402  [0402]
R106  1K  R0402  [0402]
R107  1K  R0402  [0402]
R108  2.2K  R0402  [0402]
T100  MOSFET-NCHANNELSMD  [SOT23-3]
U100  PCA9306  [PSOP-8]

### Nets
3V3: R106.1 R107.1 R108.1 U100.2(VREF1) ; also sheet 1,2,3,4
5V0: R102.2 ; also sheet 1,2
DDC_SCL: HDMI.15(SCL) R104.2 U100.6(SCL2)
DDC_SDA: HDMI.16(SDA) R103.2 U100.5(SDA2)
DETECT: HDMI.19(DETECT) R100.2 R101.1
GND: C100.2 HDMI.2(DATA2SHIELD) HDMI.5(DATA1SHIELD) HDMI.8(DATA0SHIELD) HDMI.11(CLOCKSHIELD) HDMI.14(RES) HDMI.17(DDC/CEC-GRND) R100.1 T100.2(S) U100.1(GND) ; also sheet 1,2,3,4
HDMI_DET#: R108.2 T100.3(D)
MEGA_D43: R106.2 U100.4(SDA1) ; also sheet 1
MEGA_D44: R107.2 U100.3(SCL1) ; also sheet 1
MEGA_D45: HDMI.1(DATA2+) ; also sheet 1
MEGA_D46: HDMI.3(DATA2-) ; also sheet 1
MEGA_D47: HDMI.4(DATA1+) ; also sheet 1
MEGA_D48: HDMI.6(DATA1-) ; also sheet 1
MEGA_D49: HDMI.7(DATA0+) ; also sheet 1
MEGA_D50: HDMI.9(DATA0-) ; also sheet 1
MEGA_D51: HDMI.10(CLOCK+) ; also sheet 1
MEGA_D52: HDMI.12(CLOCK-) ; also sheet 1
MEGA_D53: HDMI.13(CEC) ; also sheet 1
N$6: C100.1 R105.1 U100.7(VREF2) U100.8(EN)
N$17: R101.2 T100.1(G)
TX_HDMI_5V: HDMI.18(+5V) R102.1 R103.1 R104.1 R105.2
Unconnected: HDMI.SH1 HDMI.SH2 HDMI.SH3 HDMI.SH4

### Notes on the sheet
- Saanlima Electronics
- This section is from the Pipistrello design with permission from Magnus.
- Copyright Saanlima Electronics 2012

## Library data of the parts
AVRUSB = SmartPrj:MYCON2_USB-MINI-B
C1-C3 = Bogdan_Commons:C: CAPACITOR, European symbol
C4-C7 C10-C13 C21-C26 C32 C33 = GadgetFactory:C: CAPACITOR, European symbol
C8 C9 C15-C18 C20 C27 C29-C31 C34 = dp_devices:CAP
C14 C19 C28 = dp_devices:CAP_POL
C100 = saanlima:C
C101-C107 = SmartPrj:C-EU: CAPACITOR, European symbol
FLASH = GadgetFactory:FLASH-SPI-25XX: SPI Flash
FPGAUSB = dp_devices:CONN_USB: USB connector
HDMI = saanlima:HDMI-TYPE-A-RECEPTICAL
IC1 = DP-EagleLibrary:FT2232H: DUAL HIGH SPEED USB TO MULTIPURPOSE UART/FIFO IC
L1 L2 = Bogdan_Commons:L: INDUCTOR, European symbol
L3 L4 = dp_devices:FERRITE_BEAD
L100 = wuerth-elektronik:WE-CBF: SMD EMI Suppression Ferrite Beads - excellent anti-EMI properties - low DCR - impedances till 3000 ohms - rated current up to 6 A
LED PWR = led:LED: LED OSRAM: - CHIPLED LG R971, LG N971, LY N971, LG Q971, LY Q971, LO R971, LY R971 LH N974, LH R974 LS Q976, LO Q976, LY Q976 LO Q996 - Hyper CHIPLED LW Q18S LB Q993, LB Q99A, LB R99A - SideLED LS A670, LO A670, LY A670, LG A670, LP A670 LB A673, LV A673, LT A673, LW A673 LH A674 LY A675 LS A676, LA A676, LO A676, LY A676, LW A676 LS A679, LY A679, LG A679 - Hyper Micro SIDELED® LS Y876, LA Y876, LO Y876, LY Y876 LT Y87S - SmartLED LW L88C, LW L88S LB L89C, LB L89S, LG L890 LS L89K, LO L89K, LY L89K LS L896, LA L896, LO L896, LY L896 - TOPLED LS T670, LO T670, LY T670, LG T670, LP T670 LSG T670, LSP T670, LSY T670, LOP T670, LYG T670 LG T671, LOG T671, LSG T671 LB T673, LV T673, LT T673, LW T673 LH T674 LS T676, LA T676, LO T676, LY T676, LB T676, LH T676, LSB T676, LW T676 LB T67C, LV T67C, LT T67C, LS T67K, LO T67K, LY T67K, LW E67C LS E67B, LA E67B, LO E67B, LY E67B, LB E67C, LV E67C, LT E67C LW T67C LS T679, LY T679, LG T679 LS T770, LO T770, LY T770, LG T770, LP T770 LB T773, LV T773, LT T773, LW T773 LH T774 LS E675, LA E675, LY E675, LS T675 LS T776, LA T776, LO T776, LY T776, LB T776 LHGB T686 LT T68C, LB T68C - Hyper Mini TOPLED® LB M676 - Mini TOPLED Santana® LG M470 LS M47K, LO M47K, LY M47K Source: http://www.osram.convergy.de LUXEON: - LUMILED® LXK2-PW12-R00, LXK2-PW12-S00, LXK2-PW14-U00, LXK2-PW14-V00 LXK2-PM12-R00, LXK2-PM12-S00, LXK2-PM14-U00 LXK2-PE12-Q00, LXK2-PE12-R00, LXK2-PE12-S00, LXK2-PE14-T00, LXK2-PE14-U00 LXK2-PB12-K00, LXK2-PB12-L00, LXK2-PB12-M00, LXK2-PB14-N00, LXK2-PB14-P00, LXK2-PB14-Q00 LXK2-PR12-L00, LXK2-PR12-M00, LXK2-PR14-Q00, LXK2-PR14-R00 LXK2-PD12-Q00, LXK2-PD12-R00, LXK2-PD12-S00 LXK2-PH12-R00, LXK2-PH12-S00 LXK2-PL12-P00, LXK2-PL12-Q00, LXK2-PL12-R00 Source: www.luxeon.com KINGBRIGHT: KA-3528ASYC Source: www.kingbright.com
OSC = MondoCPLDCore-XC95_Rev1.5:OSC1
PWRIN = jumper:JP1E: JUMPER
PWRSEL = jumper:JP2E: JUMPER
R1 R7 R22 R110 = GadgetFactory_6.0:R: RESISTOR, European symbol
R2-R5 = Bogdan_Commons:R-SMALL
R6 R8-R21 R31 R32 = GadgetFactory:R: RESISTOR, European symbol
R23-R30 = dp_devices:RESISTOR
R100-R108 = saanlima:R
R109 = SmartPrj:R-EU_: RESISTOR, European symbol
RX TX = dp_devices:LED
S1 = xilinx_devices:6SLX9TQG144: Xilinx FPGA: 6SLX9TQG144
SRAM = GadgetFactory:ISSI_SRAM_8BIT
SW1 = OPL Eagle Library:SWITCH-2CH-6P*: MS-22D18 G2 ROHS
SW2 = adafruit:EVQQ2: SMT 6mm switch, EVQQ2 series http://www.ladyada.net/library/eagle
T100 = saanlima:MOSFET-NCHANNEL
U1 = GadgetFactory_tmp:ARDUINO_MEGA_SHIELD
U2 = Bogdan_Commons:LTC3419: Dual Monolithic 600mA Synchronous Step-Down Regulator
U3 = Bogdan_Commons:DIGITAL-EEPROM-MICROWIRE-6P
U100 = saanlima:PCA9306
U101 = SmartPrj:ATMEGA32U4-XU
U$1 = GadgetFactory:JTAG_XILINX
U$2-U$6 U$8 = Papilio:POWER_ONLY
X1 = dp_devices:CRYSTAL_2
Y1 = SmartPrj:CRYSTAL-3.2-2.5

## Net classes
0 default: width 0.178 mm, drill 0.381 mm, clearance 0.178 mm
1 Power: width 0.254 mm, drill 0.381 mm, clearance 0.178 mm
2 gnd: width 0.254 mm, drill 0.61 mm, clearance 0.254 mm
3 usbvcc: width 0.254 mm, drill 0.61 mm, clearance 0.254 mm
4 aref: width 0.254 mm, drill 0.61 mm, clearance 0.254 mm